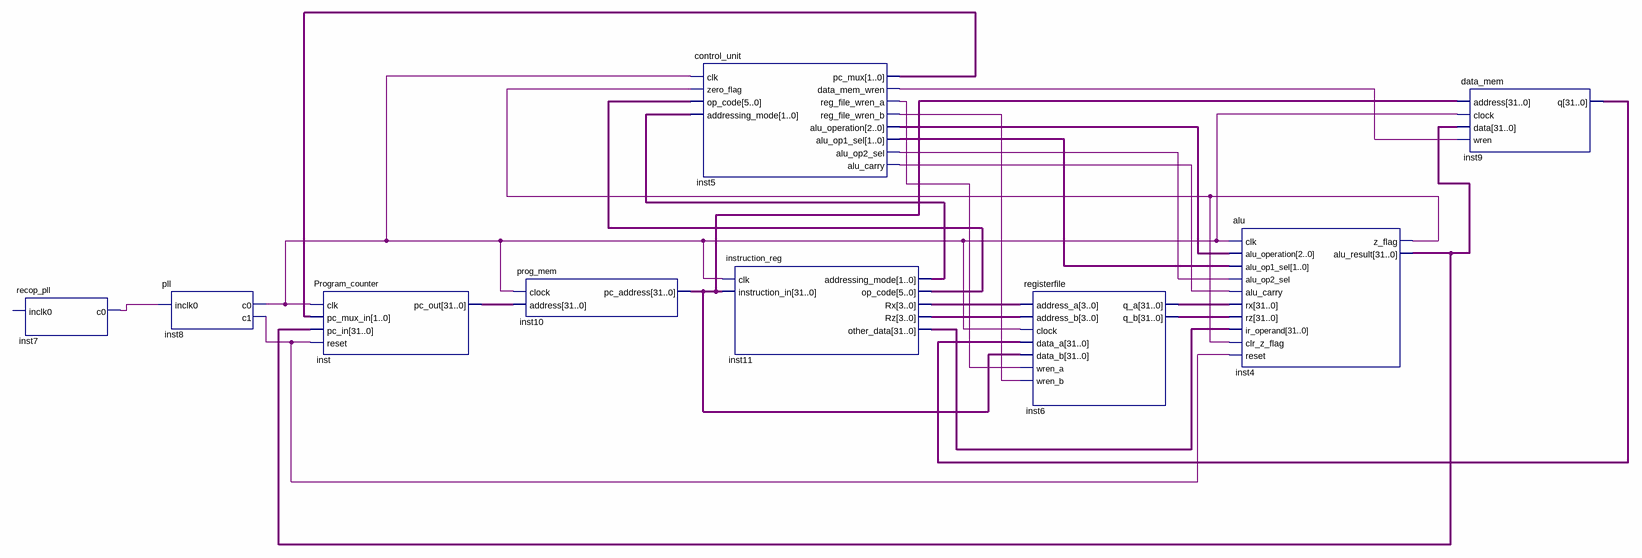
[diagram p0: schematic sheet]
// Quartus schematic recopv2.bdf as structural Verilog: 9 symbols, 0 pins
module recopv2 (
);

  wire inst4_z_flag, inst5_alu_carry, inst5_alu_op2_sel, inst5_data_mem_wren, inst5_reg_file_wren_a,
       inst5_reg_file_wren_b, inst7_c0, inst8_c0, inst8_c1;
  wire [1:0] inst5_alu_op1_sel, inst5_pc_mux, inst11_addressing_mode;
  wire [2:0] inst5_alu_operation;
  wire [3:0] inst11_rx, inst11_rz;
  wire [5:0] inst11_op_code;
  wire [31:0] inst4_alu_result, inst6_q_a, inst6_q_b, inst9_q, inst10_pc_address, inst11_other_data,
       inst_pc_out;

  recop_pll inst7 (.c0(inst7_c0));  // open: inclk0
  pll inst8 (.inclk0(inst7_c0), .c0(inst8_c0), .c1(inst8_c1));
  Program_counter inst (
    .clk(inst8_c0), .pc_mux_in(inst5_pc_mux), .pc_in(inst4_alu_result), .reset(inst8_c1), .pc_out(inst_pc_out));
  prog_mem inst10 (.clock(inst8_c0), .address(inst_pc_out), .pc_address(inst10_pc_address));
  control_unit inst5 (
    .clk(inst8_c0), .zero_flag(inst4_z_flag), .op_code(inst11_op_code),
    .addressing_mode(inst11_addressing_mode), .pc_mux(inst5_pc_mux), .data_mem_wren(inst5_data_mem_wren),
    .reg_file_wren_a(inst5_reg_file_wren_a), .reg_file_wren_b(inst5_reg_file_wren_b),
    .alu_operation(inst5_alu_operation), .alu_op1_sel(inst5_alu_op1_sel), .alu_op2_sel(inst5_alu_op2_sel),
    .alu_carry(inst5_alu_carry));
  instruction_reg inst11 (
    .clk(inst8_c0), .instruction_in(inst10_pc_address), .addressing_mode(inst11_addressing_mode),
    .op_code(inst11_op_code), .Rx(inst11_rx), .Rz(inst11_rz), .other_data(inst11_other_data));
  registerfile inst6 (
    .address_a(inst11_rx), .address_b(inst11_rz), .clock(inst8_c0), .data_a(inst9_q),
    .data_b(inst10_pc_address), .wren_a(inst5_reg_file_wren_a), .wren_b(inst5_reg_file_wren_b),
    .q_a(inst6_q_a), .q_b(inst6_q_b));
  alu inst4 (
    .clk(inst8_c0), .alu_operation(inst5_alu_operation), .alu_op1_sel(inst5_alu_op1_sel),
    .alu_op2_sel(inst5_alu_op2_sel), .alu_carry(inst5_alu_carry), .rx(inst6_q_a), .rz(inst6_q_b),
    .ir_operand(inst11_other_data), .clr_z_flag(inst4_z_flag), .reset(inst8_c1), .z_flag(inst4_z_flag),
    .alu_result(inst4_alu_result));
  data_mem inst9 (
    .address(inst10_pc_address), .clock(inst8_c0), .data(inst4_alu_result), .wren(inst5_data_mem_wren),
    .q(inst9_q));
endmodule
